# EAGLE design M302D (EAGLE 6.6.0)
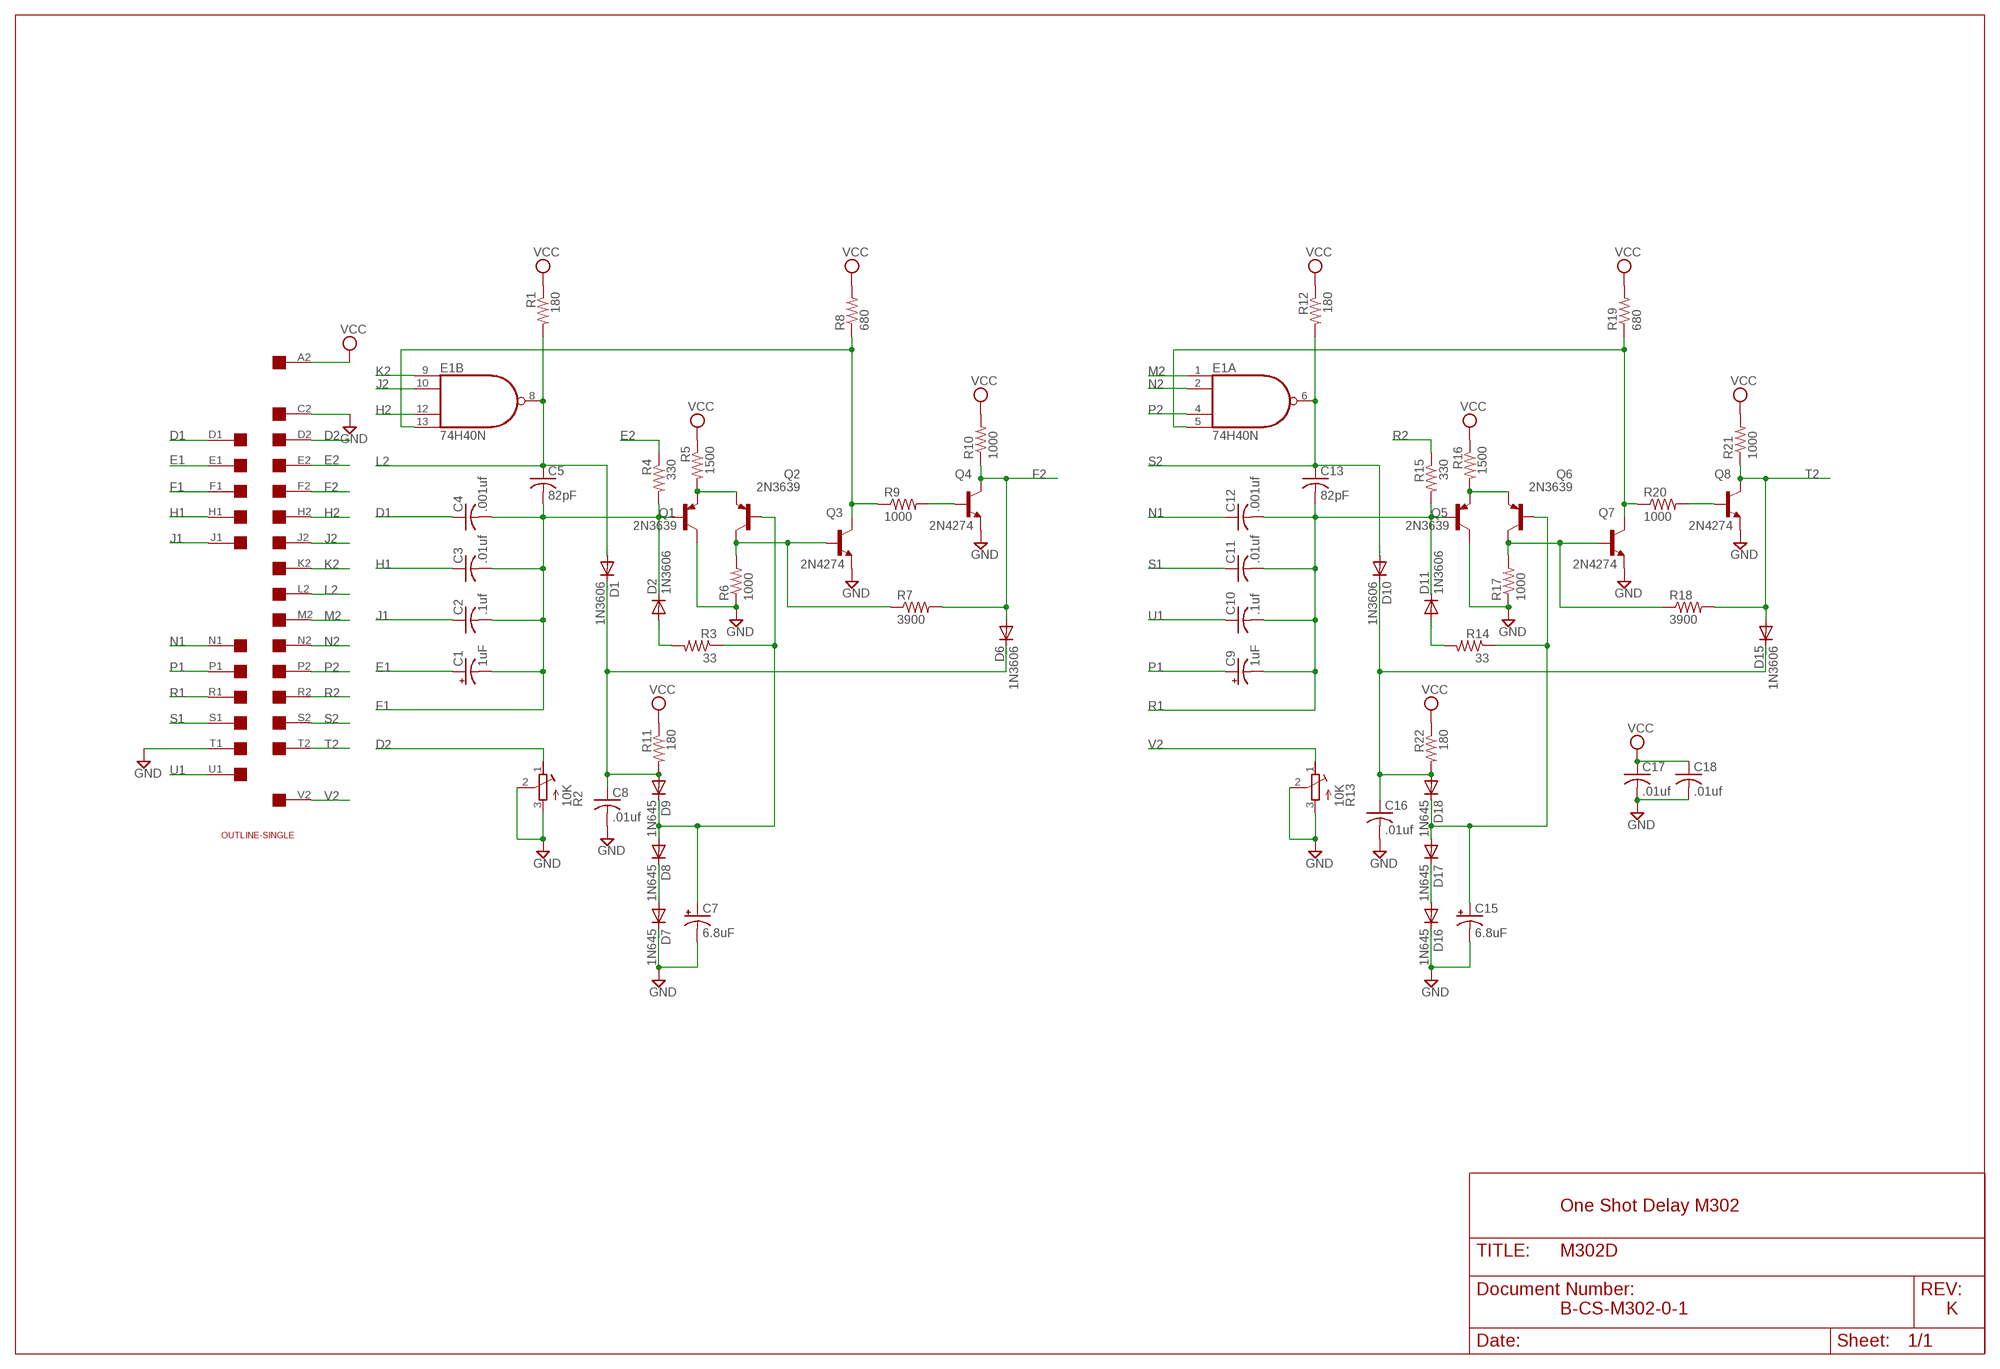
[diagram p0: schematic, sheet 1]

## Parts
C1  1uF  CPOL-USE12-4AXIAL  [E12-4]
C2  .1uf  C-US275-093X316  [C275-093X316]
C3  .01uf  C-US225-062X268  [C225-062X268]
C4  .001uf  C-US150-054X183  [C150-054X183]
C5  82pF  C-US075-032X103  [C075-032X103]
C7  6.8uF  CPOL-USE15-5AXIAL  [E15-5]
C8  .01uf  C-US050-025X075  [C050-025X075]
C9  1uF  CPOL-USE12-4AXIAL  [E12-4]
C10  .1uf  C-US275-093X316  [C275-093X316]
C11  .01uf  C-US225-062X268  [C225-062X268]
C12  .001uf  C-US150-054X183  [C150-054X183]
C13  82pF  C-US075-032X103  [C075-032X103]
C15  6.8uF  CPOL-USE15-5AXIAL  [E15-5]
C16  .01uf  C-US050-025X075  [C050-025X075]
C17  .01uf  C-US050-025X075  [C050-025X075]
C18  .01uf  C-US050-025X075  [C050-025X075]
D1  1N3606  1N4148DO35-10  [DO35-10]
D2  1N3606  1N4148DO35-10  [DO35-10]
D6  1N3606  1N4148DO35-10  [DO35-10]
D7  1N645  1N4148DO35-10  [DO35-10]
D8  1N645  1N4148DO35-10  [DO35-10]
D9  1N645  1N4148DO35-10  [DO35-10]
D10  1N3606  1N4148DO35-10  [DO35-10]
D11  1N3606  1N4148DO35-10  [DO35-10]
D15  1N3606  1N4148DO35-10  [DO35-10]
D16  1N645  1N4148DO35-10  [DO35-10]
D17  1N645  1N4148DO35-10  [DO35-10]
D18  1N645  1N4148DO35-10  [DO35-10]
E1  74H40N  74S20N  [DIL14]
Q1  2N3639  2N3637-PNP-TO39-EBC  [TO39]
Q2  2N3639  2N3637-PNP-TO39-EBC  [TO39]
Q3  2N4274  2N3019-NPN-TO39-EBC  [TO39]
Q4  2N4274  2N3019-NPN-TO39-EBC  [TO39]
Q5  2N3639  2N3637-PNP-TO39-EBC  [TO39]
Q6  2N3639  2N3637-PNP-TO39-EBC  [TO39]
Q7  2N4274  2N3019-NPN-TO39-EBC  [TO39]
Q8  2N4274  2N3019-NPN-TO39-EBC  [TO39]
R1  180  R-US_0207/10  [0207/10]
R2  10K  275P  [3006Y]
R3  33  R-US_0207/10  [0207/10]
R4  330  R-US_0207/10  [0207/10]
R5  1500  R-US_0207/10  [0207/10]
R6  1000  R-US_0207/10  [0207/10]
R7  3900  R-US_0207/10  [0207/10]
R8  680  R-US_0207/10  [0207/10]
R9  1000  R-US_0207/10  [0207/10]
R10  1000  R-US_0207/10  [0207/10]
R11  180  R-US_0207/10  [0207/10]
R12  180  R-US_0207/10  [0207/10]
R13  10K  275P  [3006Y]
R14  33  R-US_0207/10  [0207/10]
R15  330  R-US_0207/10  [0207/10]
R16  1500  R-US_0207/10  [0207/10]
R17  1000  R-US_0207/10  [0207/10]
R18  3900  R-US_0207/10  [0207/10]
R19  680  R-US_0207/10  [0207/10]
R20  1000  R-US_0207/10  [0207/10]
R21  1000  R-US_0207/10  [0207/10]
R22  180  R-US_0207/10  [0207/10]
U$1  SINGLE  [EDGE-CON2]
U$2  OUTLINE-SINGLE  [SINGLE]

## Nets
D1: C4.1 U$1.D1
D2: R2.1(A) U$1.D2
E1: C1.+ U$1.E1
E2: R4.1 U$1.E2
F1: C1.- C2.2 C3.2 C4.2 C5.2 D2.C Q1.2(B) R4.2 U$1.F1
F2: D6.A Q4.3(C) R7.2 R10.1 U$1.F2
GND [power]: C7.- C8.2 C15.- C16.2 C17.2 C18.2 D7.C D16.C Q1.3(C) Q3.1(E) Q4.1(E) Q5.3(C) Q7.1(E) Q8.1(E) R2.2(S) R2.3(E) R6.1 R13.2(S) R13.3(E) R17.1 U$1.C2 U$1.T1
H1: C3.1 U$1.H1
H2: E1.12(B:I2) U$1.H2
J1: C2.1 U$1.J1
J2: E1.10(B:I1) U$1.J2
K2: E1.9(B:I0) U$1.K2
L2: C5.1 D1.A E1.8(B:O) R1.2 U$1.L2
M2: E1.1(A:I0) U$1.M2
N1: C12.1 U$1.N1
N2: E1.2(A:I1) U$1.N2
N$1: C8.1 D1.C D6.C D9.A R11.2
N$2: Q4.2(B) R9.2
N$3: Q1.1(E) Q2.1(E) R5.2
N$4: E1.5(A:I3) Q7.3(C) R19.1 R20.1
N$5 [power]: C7.+ D8.A D9.C Q2.2(B) R3.1
N$6: Q6.3(C) Q7.2(B) R17.2 R18.1
N$7: D2.A R3.2
N$8: Q2.3(C) Q3.2(B) R6.2 R7.1
N$9: D7.A D8.C
N$10: Q5.1(E) Q6.1(E) R16.2
N$11: E1.13(B:I3) Q3.3(C) R8.1 R9.1
N$12: C15.+ D17.A D18.C Q6.2(B) R14.1
N$13: D11.A R14.2
N$14: Q8.2(B) R20.2
N$16: C16.1 D10.C D15.C D18.A R22.2
N$20: D16.A D17.C
P1: C9.+ U$1.P1
P2: E1.4(A:I2) U$1.P2
R1: C9.- C10.2 C11.2 C12.2 C13.2 D11.C Q5.2(B) R15.2 U$1.R1
R2: R15.1 U$1.R2
S1: C11.1 U$1.S1
S2: C13.1 D10.A E1.6(A:O) R12.2 U$1.S2
T2: D15.A Q8.3(C) R18.2 R21.1 U$1.T2
U1: C10.1 U$1.U1
V2: R13.1(A) U$1.V2
VCC [power]: C17.1 C18.1 R1.1 R5.1 R8.2 R10.2 R11.1 R12.1 R16.1 R19.2 R21.2 R22.1 U$1.A2
Unconnected: U$1.A1 U$1.B1 U$1.B2 U$1.C1 U$1.K1 U$1.L1 U$1.M1 U$1.U2 U$1.V1

## Notes on the sheet
- One Shot Delay M302
- B-CS-M302-0-1 | K

## Power pins joined to a net without a drawn wire
GND: E1.7(P:GND)
VCC: E1.14(P:VCC)

## Library data of the parts
C1 C9 = dec-con:CPOL-USE12-4AXIAL: 0.5" veresion of an electrolytic
C2-C5 C8 C10-C13 C16-C18 = rcl:C-US: CAPACITOR, American symbol
C7 C15 = rcl:CPOL-US: POLARIZED CAPACITOR, American symbol
D1 D2 D6-D11 D15-D18 = diode:1N4148: DIODE high speed (Philips)
E1 = 74xx-us:74*20: Dual 4-input NAND gate
Q1 Q2 Q5 Q6 = transistor:*-PNP-: PNP Transistror
Q3 Q4 Q7 Q8 = transistor:*-NPN-: NPN Transistror BF959 corrected 2008.03.06
R1 R3-R12 R14-R22 = rcl:R-US_: RESISTOR, American symbol
R2 R13 = dec-con:275P: Trimpot with 275P (3006Y) footprint.
U$1 = dec-con:SINGLE: Single-Height DEC board
U$2 = dec-con:OUTLINE-*: Board outlines for DEC boards.

## Net classes
1 power: width 0.813 mm, clearance 0.508 mm

## Board
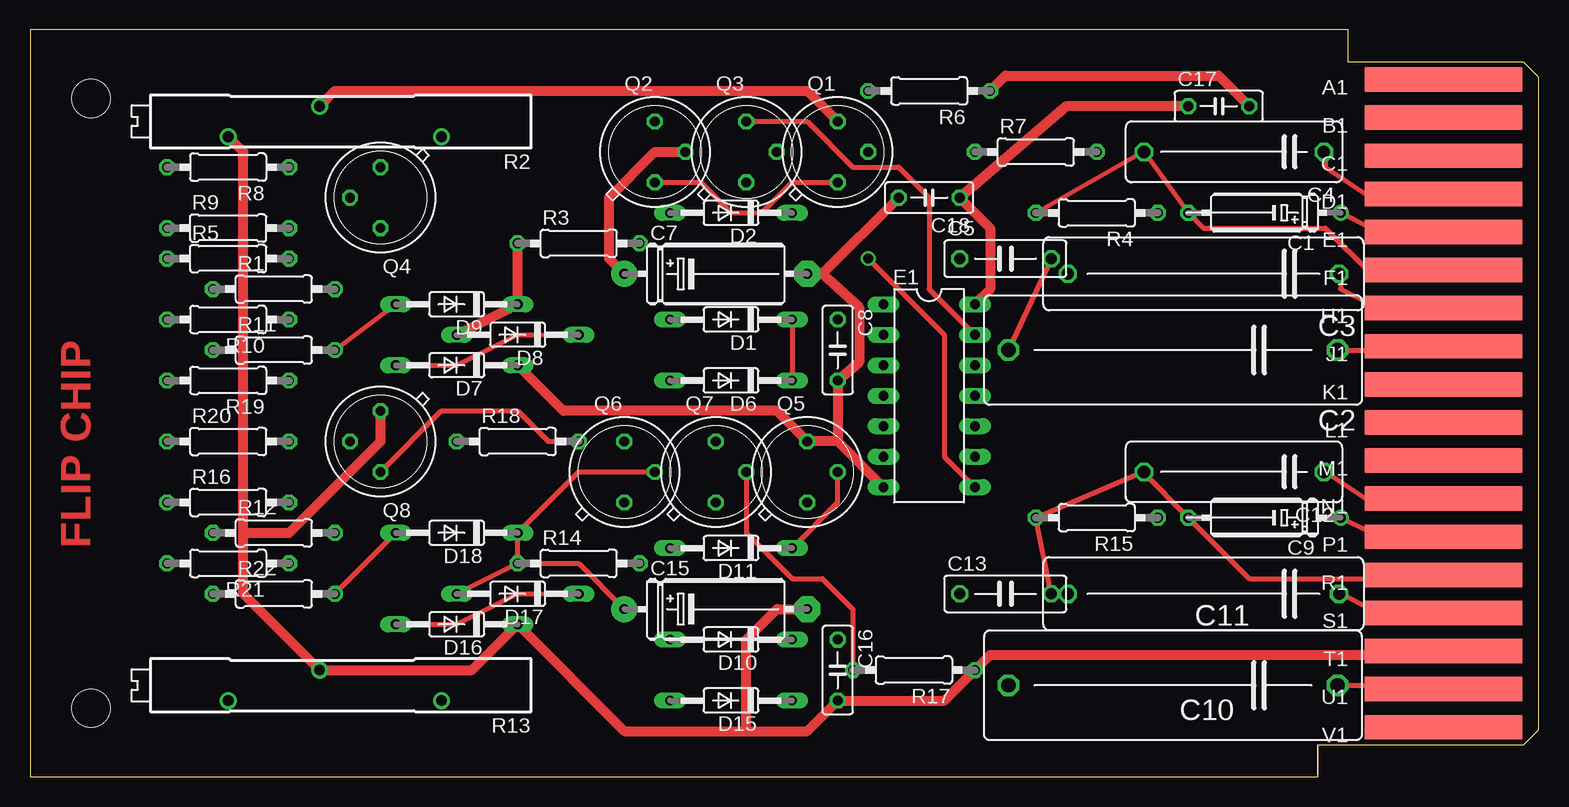
[diagram p1: board, top side]
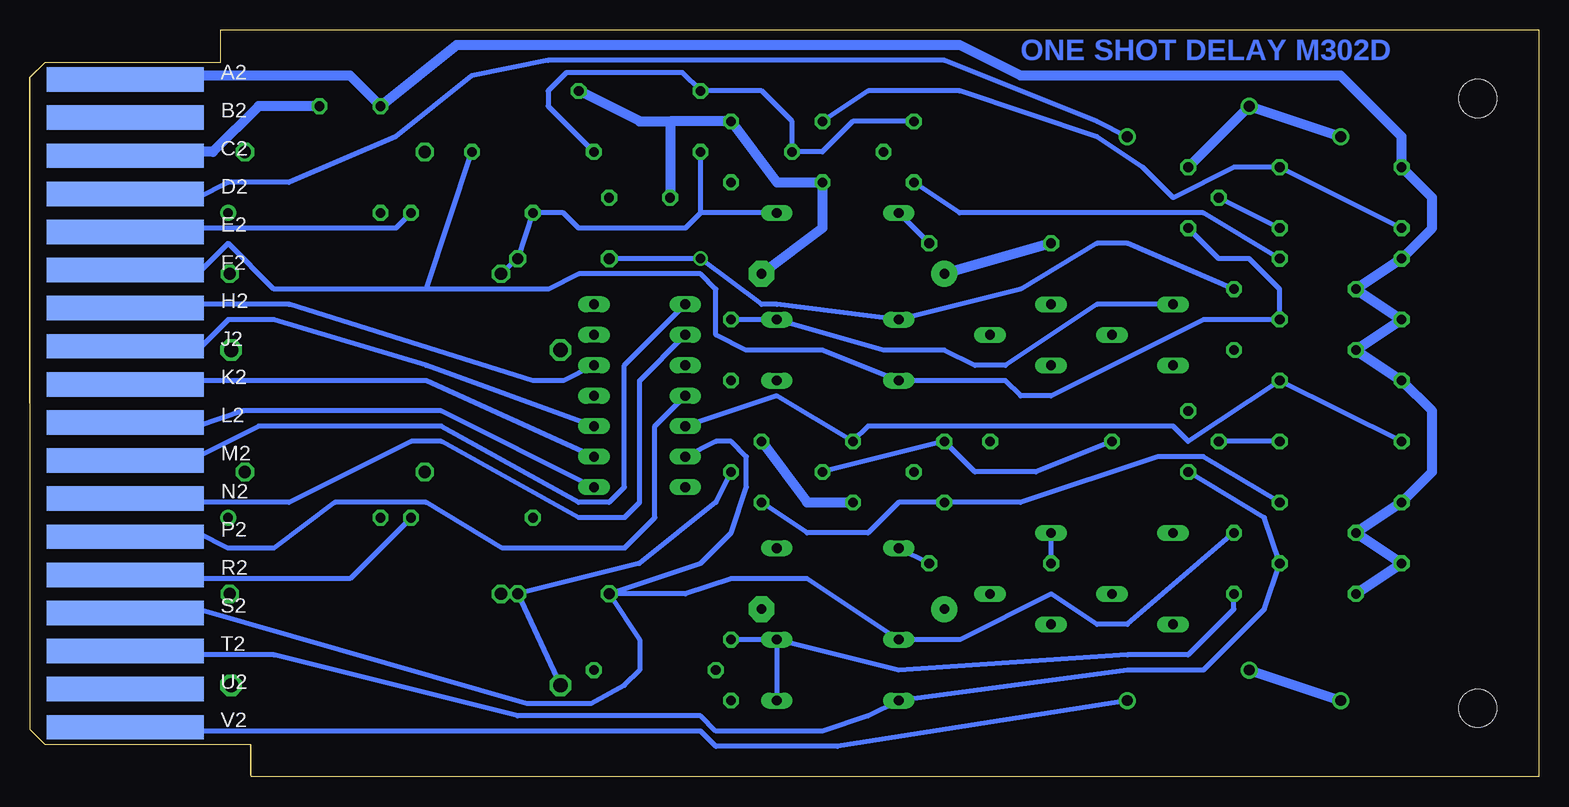
[diagram p2: board, bottom side, seen from below]

Size 125.73 x 62.23 mm. Coordinates in mm from the lower left corner, seen from the top.
Copper layers (1+16): Top 0.035mm / dielectric 1.5mm / Bottom 0.035mm
Design rules "16mils": minimum track width 16mil, minimum drill 32mil, track to track 15mil, track to pad 10mil, pad to pad 10mil, via to via 10mil, smd to smd 10mil, copper to edge 13mil, drill to drill 10mil, minimum pad ring 10mil, minimum via ring 8mil, stop-mask expansion 0mil, vias tented up to drill 0mil, thermal gap 10mil

### Footprints (pad centres in the part's own frame; a part is rotated, then mirrored left to right if it is on the bottom)
E12-4 = drill 0.813: + -7.62,0 | drill 0.813 octagon: - 5.08,0
C275-093X316 = drill 1.194 octagon: 1 -13.716,0; 2 13.716,0
C225-062X268 = drill 1.016 octagon: 1 -11.303,0; 2 11.303,0
C150-054X183 = drill 1.016 octagon: 1 -7.493,0; 2 7.493,0
C075-032X103 = drill 0.914 octagon: 1 -3.81,0; 2 3.81,0
E15-5 = drill 0.813 pad 2.159: + -7.62,0 | drill 0.813 pad 2.159 octagon: - 7.62,0
C050-025X075 = drill 0.813 octagon: 1 -2.54,0; 2 2.54,0
DO35-10 = drill 0.813 long: A 5.08,0; C -5.08,0
DIL14 = drill 0.813 long: 1 -7.62,-3.81; 2 -5.08,-3.81; 3 -2.54,-3.81; 4 0,-3.81; 5 2.54,-3.81; 6 5.08,-3.81; 7 7.62,-3.81; 8 7.62,3.81; 9 5.08,3.81; 10 2.54,3.81; 11 0,3.81; 12 -2.54,3.81; 13 -5.08,3.81; 14 -7.62,3.81
TO39 = drill 0.813 octagon: 1 0,-2.54; 2 2.54,0; 3 0,2.54
0207/10 = drill 0.813 octagon: 1 -5.08,0; 2 5.08,0
3006Y = drill 0.9: 1 -8.89,1.27; 2 1.27,-1.27; 3 8.89,1.27
EDGE-CON2 = smd 13.106 x 2.032: A1 7.938,4.128; B1 7.938,7.303; C1 7.938,10.477; D1 7.938,13.652; E1 7.938,16.828; F1 7.938,20.003; H1 7.938,23.177; J1 7.938,26.352; K1 7.938,29.527; L1 7.938,32.703; M1 7.938,35.877; N1 7.938,39.053; P1 7.938,42.227; R1 7.938,45.403; S1 7.938,48.578; T1 7.938,51.752; U1 7.938,54.928; V1 7.938,58.102 | smd 13.106 x 2.032 bottom: A2 7.938,4.128; B2 7.938,7.303; C2 7.938,10.477; D2 7.938,13.652; E2 7.938,16.828; F2 7.938,20.003; H2 7.938,23.177; J2 7.938,26.352; K2 7.938,29.527; L2 7.938,32.703; M2 7.938,35.877; N2 7.938,39.053; P2 7.938,42.227; R2 7.938,45.403; S2 7.938,48.578; T2 7.938,51.752; U2 7.938,54.928; V2 7.938,58.102
SINGLE = hole 3.175: 120.65,56.515; 120.65,5.715

### Placement (x,y rotation side)
C1  101.6,46.99 180 top
C2  95.25,35.56 180 top
C3  97.79,41.91 180 top
C4  100.33,52.07 180 top
C5  81.28,43.18 0 top
C7  57.15,41.91 0 top
C8  67.31,35.56 270 top
C9  101.6,21.59 180 top
C10  95.25,7.62 180 top
C11  97.79,15.24 180 top
C12  100.33,25.4 180 top
C13  81.28,15.24 0 top
C15  57.15,13.97 0 top
C16  67.31,8.89 270 top
C17  99.06,55.88 0 top
C18  74.93,48.26 180 top
D1  58.42,38.1 180 top
D2  58.42,46.99 180 top
D6  58.42,33.02 180 top
D7  35.56,34.29 180 top
D8  40.64,36.83 180 top
D9  35.56,39.37 180 top
D10  58.42,11.43 180 top
D11  58.42,19.05 180 top
D15  58.42,6.35 180 top
D16  35.56,12.7 180 top
D17  40.64,15.24 180 top
D18  35.56,20.32 180 top
E1  74.93,31.75 270 top
Q1  67.31,52.07 0 top
Q2  52.07,52.07 0 top
Q3  59.69,52.07 0 top
Q4  29.21,48.26 180 top
Q5  64.77,25.4 0 top
Q6  49.53,25.4 0 top
Q7  57.15,25.4 0 top
Q8  29.21,27.94 180 top
R1  20.32,40.64 0 top
R2  25.4,54.61 180 top
R3  45.72,44.45 0 top
R4  88.9,46.99 180 top
R5  16.51,43.18 0 top
R6  74.93,57.15 180 top
R7  83.82,52.07 0 top
R8  16.51,50.8 180 top
R9  16.51,45.72 0 top
R10  16.51,38.1 180 top
R11  20.32,35.56 0 top
R12  20.32,20.32 0 top
R13  25.4,7.62 180 top
R14  45.72,17.78 0 top
R15  88.9,21.59 180 top
R16  16.51,22.86 0 top
R17  73.66,8.89 180 top
R18  40.64,27.94 0 top
R19  16.51,33.02 180 top
R20  16.51,27.94 0 top
R21  16.51,17.78 180 top
R22  20.32,15.24 0 top
U$1  125.73,62.23 180 top
U$2  125.73,62.23 180 top
U$3  [FLIPCHIP]  0,0 0 top

### Tracks (layer width: path | path; a pad name or v marks a point on that pad's centre or on a via)
D1
  Top 0.406: U$1.D1 116.84,48.26 111.76,48.26 107.95,50.8 107.95,52.07 C4.1
D2
  Bottom 0.406: U$1.D2 116.84,48.26 111.76,48.26 109.22,49.53 104.14,49.53 95.25,53.34 88.9,58.42 82.55,59.69 49.53,59.69 36.83,54.61 R2.1
E1
  Top 0.406: U$1.E1 116.84,45.72 111.76,45.72 C1.+
E2
  Bottom 0.406: U$1.E2 117.17,45.39 116.84,45.72 95.25,45.72 R4.1
F1
  Top 0.406: U$1.F1 116.84,41.91 111.76,41.91 107.95,45.72 97.79,45.72 C1.- C4.2 92.71,52.07 R4.2 | C5.2 C2.2
  Bottom 0.406: C3.2 C5.2 R4.2 81.28,46.99 80.01,45.72 71.12,45.72 69.85,46.99 | 69.85,46.99 Q1.2 | D2.C 69.85,46.99
F2
  Bottom 0.406: U$1.F2 116.84,41.91 111.76,41.91 109.22,44.45 105.41,40.64 92.71,40.64 | 92.71,40.64 R7.2 | Q4.3 26.67,43.18 24.13,43.18 21.59,40.64 R10.1 27.94,38.1 40.64,31.75 43.18,31.75 44.45,33.02 D6.A 59.69,35.56 66.04,35.56 68.58,36.83 68.58,40.64 69.85,41.91 80.01,41.91 82.55,40.64 92.71,40.64
GND
  Top 0.813: R6.1 81.28,58.42 99.06,58.42 C17.2 | 67.31,27.94 Q5.3 62.23,30.48 44.45,30.48 D7.C | 67.31,27.94 C8.2 69.09,34.54 69.09,39.12 66.04,41.91 | 67.31,27.94 E1.7 | C18.2 66.04,41.91 | 66.04,41.91 C7.- | U$1.T1 116.84,10.16 80.01,10.16 R17.1 76.2,6.35 C16.2 64.77,3.81 59.69,3.81 | R2.3 17.78,52.07 17.78,20.32 | 17.78,20.32 17.78,15.24 R13.2 36.83,8.89 D16.C 49.53,3.81 59.69,3.81 | 59.69,3.81 59.69,11.43 62.23,13.97 C15.- | Q8.1 29.21,27.94 21.59,20.32 17.78,20.32 | R2.2 25.4,57.15 64.77,57.15 Q1.3
  Bottom 0.813: U$1.C2 116.84,52.07 110.49,52.07 106.68,55.88 C17.2 | R13.3 R13.2 | R2.3 R2.2 Q4.1 | 72.39,54.61 Q1.3 63.5,49.53 Q3.1 59.69,45.72 C7.- | R6.1 74.93,54.61 72.39,54.61 | 72.39,54.61 C18.2 | Q7.1 60.96,22.86 Q5.3
H1
  Top 0.406: U$1.H1 117.17,39.04 116.84,39.37 111.76,39.37 109.22,40.64 109.22,41.91 C3.1
H2
  Bottom 0.406: U$1.H2 116.84,39.37 104.14,39.37 83.82,33.02 81.28,33.02 E1.12
J1
  Top 0.406: U$1.J1 117.17,35.89 116.84,35.56 C2.1
J2
  Bottom 0.406: U$1.J2 116.84,35.56 111.76,35.56 109.22,38.1 105.41,38.1 92.71,34.29 E1.10
K2
  Bottom 0.406: U$1.K2 116.84,33.02 92.71,33.02 E1.9
L2  (via drill 0.81)
  Top 0.406: v69.85,43.18 76.2,36.83 76.2,26.67 E1.8
  Bottom 0.406: U$1.L2 116.84,29.21 111.76,29.21 107.95,30.48 91.44,30.48 E1.8 | C5.1 v69.85,43.18 64.77,39.37 63.5,39.37 D1.A 43.18,40.64 36.83,44.45 34.29,44.45 R1.2
M2
  Bottom 0.406: U$1.M2 116.84,26.67 111.76,26.67 106.68,29.21 91.44,29.21 80.01,22.86 77.47,22.86 76.2,24.13 76.2,34.29 E1.1
N1
  Top 0.406: U$1.N1 117.17,23.19 116.84,22.86 111.76,22.86 107.95,25.4 C12.1
N2
  Bottom 0.406: U$1.N2 116.84,22.86 104.14,22.86 93.98,27.94 91.44,27.94 80.01,21.59 76.2,21.59 74.93,22.86 74.93,33.02 E1.2
N$1
  Top 0.406: R11.2 D9.A | D1.C D6.C
  Bottom 0.406: D9.A 36.83,39.37 44.45,34.29 46.99,34.29 49.53,35.56 54.61,35.56 D1.C C8.1
N$2
  Bottom 0.406: R9.2 Q4.2
N$3
  Top 0.406: Q2.1 55.88,49.53 58.42,46.99 60.96,46.99 63.5,49.53 Q1.1
  Bottom 0.406: Q2.1 48.26,46.99 27.94,46.99 R5.2
N$4
  Bottom 0.406: E1.5 63.5,31.75 Q7.3 55.88,29.21 30.48,29.21 29.21,27.94 R19.1 R20.1
N$5
  Top 0.813: D8.A D9.C R3.1 | Q2.2 52.07,52.07 48.26,48.26 48.26,43.18 C7.+
  Bottom 0.813: R3.1 C7.+
N$6
  Top 0.406: Q7.2 59.69,20.32 63.5,16.51 66.04,16.51 68.58,13.97 R17.2
  Bottom 0.406: Q7.2 Q6.3 46.99,25.4 41.91,25.4 R18.1
N$7
  Bottom 0.406: R3.2 D2.A
N$8
  Bottom 0.406: Q2.3 57.15,54.61 59.69,52.07 Q3.2 62.23,54.61 64.77,57.15 R6.2 71.37,58.67 81.03,58.67 82.55,57.15 82.55,55.88 R7.1
N$9
  Top 0.406: D7.A 35.56,34.29 40.64,36.83 D8.C
N$10
  Bottom 0.406: Q5.1 60.96,20.32 55.88,20.32 53.34,22.86 Q6.1 43.18,22.86 31.75,26.67 27.94,26.67 R16.2
N$11
  Top 0.406: E1.13 74.93,40.64 74.93,48.26 72.39,50.8 68.58,50.8 64.77,54.61 Q3.3
  Bottom 0.406: Q3.3 55.88,57.15 48.26,57.15 36.83,53.34 33.02,50.8 30.48,48.26 25.4,50.8 R8.1 R9.1
N$12
  Top 0.406: D17.A R14.1 | R14.1 D18.C 45.72,25.4 Q6.2 | C15.+ 45.72,17.78 R14.1
  Bottom 0.406: R14.1 D18.C
N$13
  Bottom 0.406: R14.2 D11.A
N$14
  Bottom 0.406: R20.2 Q8.2
N$16
  Top 0.406: R22.2 D18.A
  Bottom 0.406: R22.2 25.4,13.97 29.21,10.16 34.29,10.16 53.34,8.89 D10.C | D10.C C16.1 | D10.C D15.C
N$20
  Top 0.406: D16.A 35.56,12.7 40.64,15.24 D17.C
P1
  Top 0.406: U$1.P1 117.17,19.99 116.84,20.32 111.76,20.32 C9.+
P2
  Bottom 0.406: E1.4 73.66,29.21 73.66,21.59 76.2,19.05 86.36,19.05 92.71,22.86 100.33,22.86 105.41,19.05 109.22,19.05 111.76,20.32 116.84,20.32 U$1.P2
R1
  Top 0.406: U$1.R1 117.17,16.84 116.84,16.51 101.6,16.51 C9.- 92.71,25.4 | 92.71,25.4 C12.2 | 92.71,25.4 R15.2 C13.2 | D11.C 67.31,22.86 Q5.2
  Bottom 0.406: C13.2 C11.2 | C13.2 C10.2 | C13.2 74.93,17.78 68.58,22.86 Q5.2
R2
  Bottom 0.406: U$1.R2 117.17,16.84 116.84,16.51 99.06,16.51 R15.1
S1
  Top 0.406: U$1.S1 117.14,13.66 116.84,13.97 111.76,13.97 109.22,15.24 C11.1
S2
  Bottom 0.406: C13.1 74.93,11.43 74.93,8.89 76.2,7.62 78.99,6.1 84.33,6.1 111.76,13.97 116.84,13.97 U$1.S2 | E1.6 68.58,27.94 67.31,27.94 66.04,26.67 66.04,24.13 67.31,20.32 69.85,17.78 C13.1 | C13.1 71.12,15.24 67.31,16.51 60.96,16.51 D10.A 48.26,11.43 40.64,15.24 36.83,12.7 34.29,12.7 R12.2
T2
  Top 0.406: R18.2 43.18,27.94 40.64,30.48 34.29,30.48 Q8.3
  Bottom 0.406: U$1.T2 116.84,10.16 105.41,10.16 85.09,5.08 69.85,5.08 68.58,3.81 59.69,3.81 55.88,5.08 D15.A 34.29,8.89 27.94,8.89 22.86,13.97 R21.1 22.86,21.59 Q8.3
U1
  Top 0.406: U$1.U1 117.2,7.26 116.84,7.62 C10.1
V2
  Bottom 0.406: U$1.V2 116.84,3.81 69.85,3.81 68.58,2.54 58.42,2.54 R13.1
VCC
  Top 0.813: C17.1 86.36,55.88 C18.1 80.01,45.72 80.01,40.64 E1.14
  Bottom 0.813: U$1.A2 116.84,58.42 99.06,58.42 C17.1 90.17,60.96 48.26,60.96 43.18,58.42 16.51,58.42 11.43,53.34 R8.2 8.89,48.26 8.89,45.72 R5.1 R1.1 R10.2 R11.1 R19.2 8.89,30.48 8.89,25.4 R16.1 R12.1 R21.2 R22.1

### Text on the board
Bottom: ONE SHOT DELAY M302D